# Altium schematic sheet connect.SchDoc
size A4
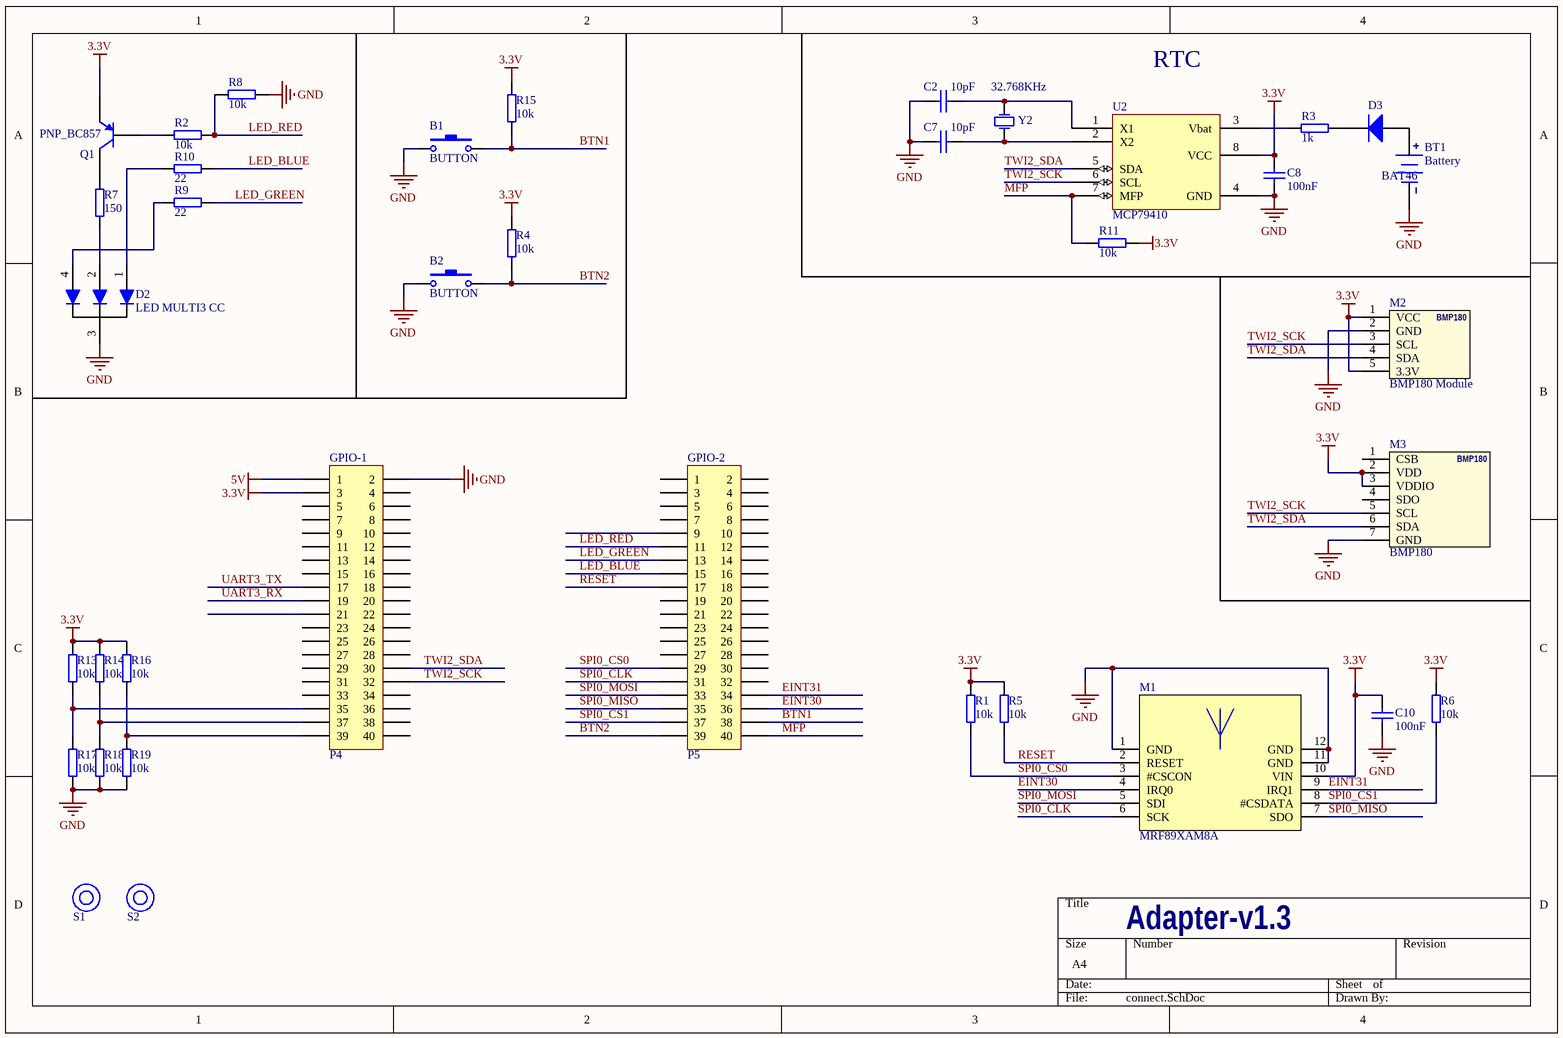
[diagram p0: connect.SchDoc]

## Parts
B1  BUTTON  [SPST_BTN]
B2  BUTTON  [SPST_BTN]
BT1  Battery  [BATT1220-horizontal]
C2  10pF  [C0805]
C7  10pF  [C0805]
C8  100nF  [C0805]
C10  100nF  [C0805]
D2  LED MULTI3 CC  [LED_MULTI - AXIAL]
D3  BAT46  [SOD-323]
M1  MRF89XAM8A  [MRF89XAM8A]
M2  BMP180 Module  [BMP180_MODULE]
M3  BMP180  [BMP180]
P4  GPIO-1  [HDR127-20-F]
P5  GPIO-2  [HDR127-20-F]
Q1  PNP_BC857  [SOT23]
R1  10k  [R0805]
R2  10k  [R0805]
R3  1k  [R0805]
R4  10k  [R0805]
R5  10k  [R0805]
R6  10k  [R0805]
R7  150  [R0805]
R8  10k  [R0805]
R9  22  [R0805]
R10  22  [R0805]
R11  10k  [R0805]
R13  10k  [R0805]
R14  10k  [R0805]
R15  10k  [R0805]
R16  10k  [R0805]
R17  10k  [R0805]
R18  10k  [R0805]
R19  10k  [R0805]
S1  TARGET  [TARGET]  (value not drawn)
S2  TARGET  [TARGET]  (value not drawn)
U2  MCP79410  [SO8_M]
Y2  32.768KHz  [R38]

## Nets
3.3V: C8.2 C10.2 M1.10(VIN) M2.1(VCC) M2.5(3.3V) M3.2(VDD) M3.3(VDDIO) P4.3 Q1.2(E) R1.2 R4.2 R5.2 R6.2 R11.1 R13.1 R14.1 R15.2 R16.1 U2.8(VCC)
5V: P4.1
GND: B1.1 B2.1 BT1.2(-) C2.1 C7.1 C8.1 C10.1 D2.3(C) M1.1(GND) M1.11(GND) M1.12(GND) M2.2(GND) M3.7(GND) P4.2 R8.1 R17.2 R18.2 R19.2 U2.4(GND)
BTN1: B1.2 P5.38 R15.1
BTN2: B2.2 P5.39 R4.1
EINT30: M1.4(IRQ0) P5.36
EINT31: M1.9(IRQ1) P5.34
LED_BLUE: P5.15 R10.2
LED_GREEN: P5.13 R9.1
LED_RED: P5.11 R2.1 R8.2
MFP: P5.40 R11.2 U2.7(MFP)
RESET: M1.2(RESET) P5.17 R5.1
SPI0_CLK: M1.6(SCK) P5.31
SPI0_CS0: M1.3(#CSCON) P5.29 R1.1
SPI0_CS1: M1.8(#CSDATA) P5.37 R6.1
SPI0_MISO: M1.7(SDO) P5.35
SPI0_MOSI: M1.5(SDI) P5.33
TWI2_SCK: M2.3(SCL) M3.5(SCL) P4.32 U2.6(SCL)
TWI2_SDA: M2.4(SDA) M3.6(SDA) P4.30 U2.5(SDA)
UART3_RX: P4.19
UART3_TX: P4.17
NetBT1_1: BT1.1(+) D3.1(A)
NetC2_2: C2.2 U2.1(X1) Y2.2(OSC2)
NetC7_2: C7.2 U2.2(X2) Y2.1(OSC1)
NetD2_1: D2.1(C) R10.1
NetD2_2: D2.2(A) R7.2
NetD2_4: D2.4(C) R9.2
NetD3_2: D3.2(K) R3.2
NetP4_35: P4.35 R13.2 R17.1
NetP4_37: P4.37 R14.2 R18.1
NetP4_39: P4.39 R16.2 R19.1
NetQ1_1: Q1.1(B) R2.2
NetQ1_3: Q1.3(C) R7.1
NetR3_1: R3.1 U2.3(Vbat)

Not connected (* = marked no-connect by the designer): M3 1(CSB) 4(SDO); P4 4 5 6 7 8 9 10 11 12 13 14 15 16 18 20 21 22 23 24 25 26 27 28 29 31 33 34 36 38 40; P5 1 2 3 4 5 6 7 8 9 10 12 14 16 18 19 20 21 22 23 24 25 26 27 28 30 32

## Notes on the sheet
- RTC
- Adapter-v1.3
- (in symbol BMP180_MODULE) BMP180

## Library data of the parts
B1 B2 = SW-PB_1: Switch Button KSS341G; Published: 24-Mar-1999; LatestRevisionDate: 17-Jul-2002; LatestRevisionNote: Re-released for DXP Platform.; PackageReference: Button KSS341G SMD; ITT; 7x3.1 mm; Publisher: Altium Limited
BT1 = Battery: Multicell Battery; Published: 24-Mar-1999; LatestRevisionDate: 17-Jul-2002; LatestRevisionNote: Re-released for DXP Platform.; PackageReference: BAT-2; Publisher: Altium Limited
C2 C7 C8 C10 = Cap: Capacitor; Published: 8-Jun-2000; LatestRevisionDate: 17-Jul-2002; LatestRevisionNote: Re-released for DXP Platform.; PackageReference: 0402; Publisher: Altium Limited
  C2 C7: Value: 10pF
  C8 C10: Value: 100nF
D2 = LED MULTI3 CC: COMMON CATHODE, HSMF-A211-A00J1 - LED, SMD, RED/YEL-GRN; TME: LL-509RGBC2E-002
D3 = Diode: Default Diode; pin to pad: 1>2 2>1; Value: S2D; Published: 8-Jun-2000; LatestRevisionDate: 17-Jul-2002; LatestRevisionNote: Re-released for DXP Platform.; PackageDocument: Sep-1996; PackageReference: SMB; Publisher: Altium Limited; Code_JEDEC: DO-214-AA; Manufacture: *; Farnell: *
M1 = MRF89XAM8A: 868 MHz Ultra-Low Power  Sub-GHz Transceiver Module; farnell: 1875307
M2 = BMP180_MODULE: Digital Barometric Pressure Sensor Module
M3 = BMP180: Digital pressure sensor
P4 P5 = HDR127 20X2: Header, 40-Pin, pitch 1.27mm; LatestRevisionDate: 17-Jul-2002; LatestRevisionNote: Re-released for DXP Platform.; Publisher: Altium Limited; suplier: https://www.olimex.com/Products/Components/Connectors/FEMALE-YAV36P-2x20/
Q1 = PNP_BC857: PNP Bipolar Transistor; Published: 8-Jun-2000; LatestRevisionDate: 17-Jul-2002; LatestRevisionNote: Re-released for DXP Platform.; PackageReference: SOT-23B; Publisher: Altium Limited; Code_JEDEC: SOT-23
R1-R11 R13-R19 = Res2: Resistor; Published: 8-Jun-2000; LatestRevisionDate: 17-Jul-2002; LatestRevisionNote: Re-released for DXP Platform.; PackageReference: 0603; Publisher: Altium Limited
  R1 R2 R4-R6 R8 R11 R13-R19: Value: 10k
  R3: Value: 1k
  R7: Value: 150
  R9 R10: Value: 22
U2 = MCP79410: Microchip i2c RTC real time clock; farnell: 2098890
Y2 = XTAL: Crystal Oscillator; Value: 25MHz; Published: 8-Jun-2000; LatestRevisionDate: 17-Jul-2002; LatestRevisionNote: Re-released for DXP Platform.; PackageReference: R38; Publisher: Altium Limited; farnell: 1652573